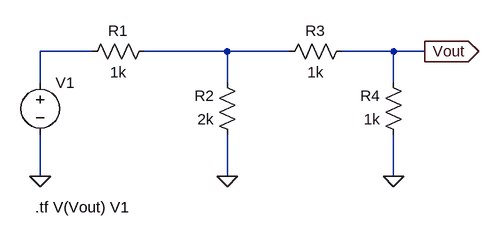
[diagram p0: schematic Rnet.asc]
Rnet.asc, the LTspice schematic file:
Version 4
SHEET 1 880 680
WIRE 64 80 -16 80
WIRE 272 80 144 80
WIRE 368 80 272 80
WIRE 528 80 448 80
WIRE 576 80 528 80
WIRE -16 128 -16 80
WIRE 272 128 272 80
WIRE 528 128 528 80
WIRE -16 272 -16 208
WIRE 272 272 272 208
WIRE 528 272 528 208
FLAG -16 272 0
FLAG 272 272 0
FLAG 528 272 0
FLAG 576 80 Vout
IOPIN 576 80 Out
SYMBOL res 160 64 R90
WINDOW 0 0 56 VBottom 2
WINDOW 3 32 56 VTop 2
SYMATTR InstName R1
SYMATTR Value 1k
SYMBOL voltage -16 112 R0
WINDOW 3 30 91 Left 2
WINDOW 123 24 44 Left 2
WINDOW 39 0 0 Left 2
SYMATTR Value ""
SYMATTR InstName V1
SYMBOL res 288 224 R180
WINDOW 0 36 76 Left 2
WINDOW 3 36 40 Left 2
SYMATTR InstName R2
SYMATTR Value 2k
SYMBOL res 464 64 R90
WINDOW 0 0 56 VBottom 2
WINDOW 3 32 56 VTop 2
SYMATTR InstName R3
SYMATTR Value 1k
SYMBOL res 544 224 R180
WINDOW 0 36 76 Left 2
WINDOW 3 36 40 Left 2
SYMATTR InstName R4
SYMATTR Value 1k
TEXT -24 320 Left 2 !.tf V(Vout) V1

The netlist it stands for:
* Rnet.asc
R1 N002 N001 1k
V1 N001 0
R2 0 N002 2k
R3 Vout N002 1k
R4 0 Vout 1k
.tf V(Vout) V1
.backanno
.end